# Altium schematic sheet ShV_1.SchDoc
size A4; Organization: Altium Limited; Address1: L3, 12a Rodborough Rd; Address2: Frenchs Forest; Address3: NSW; Address4: Australia 2086
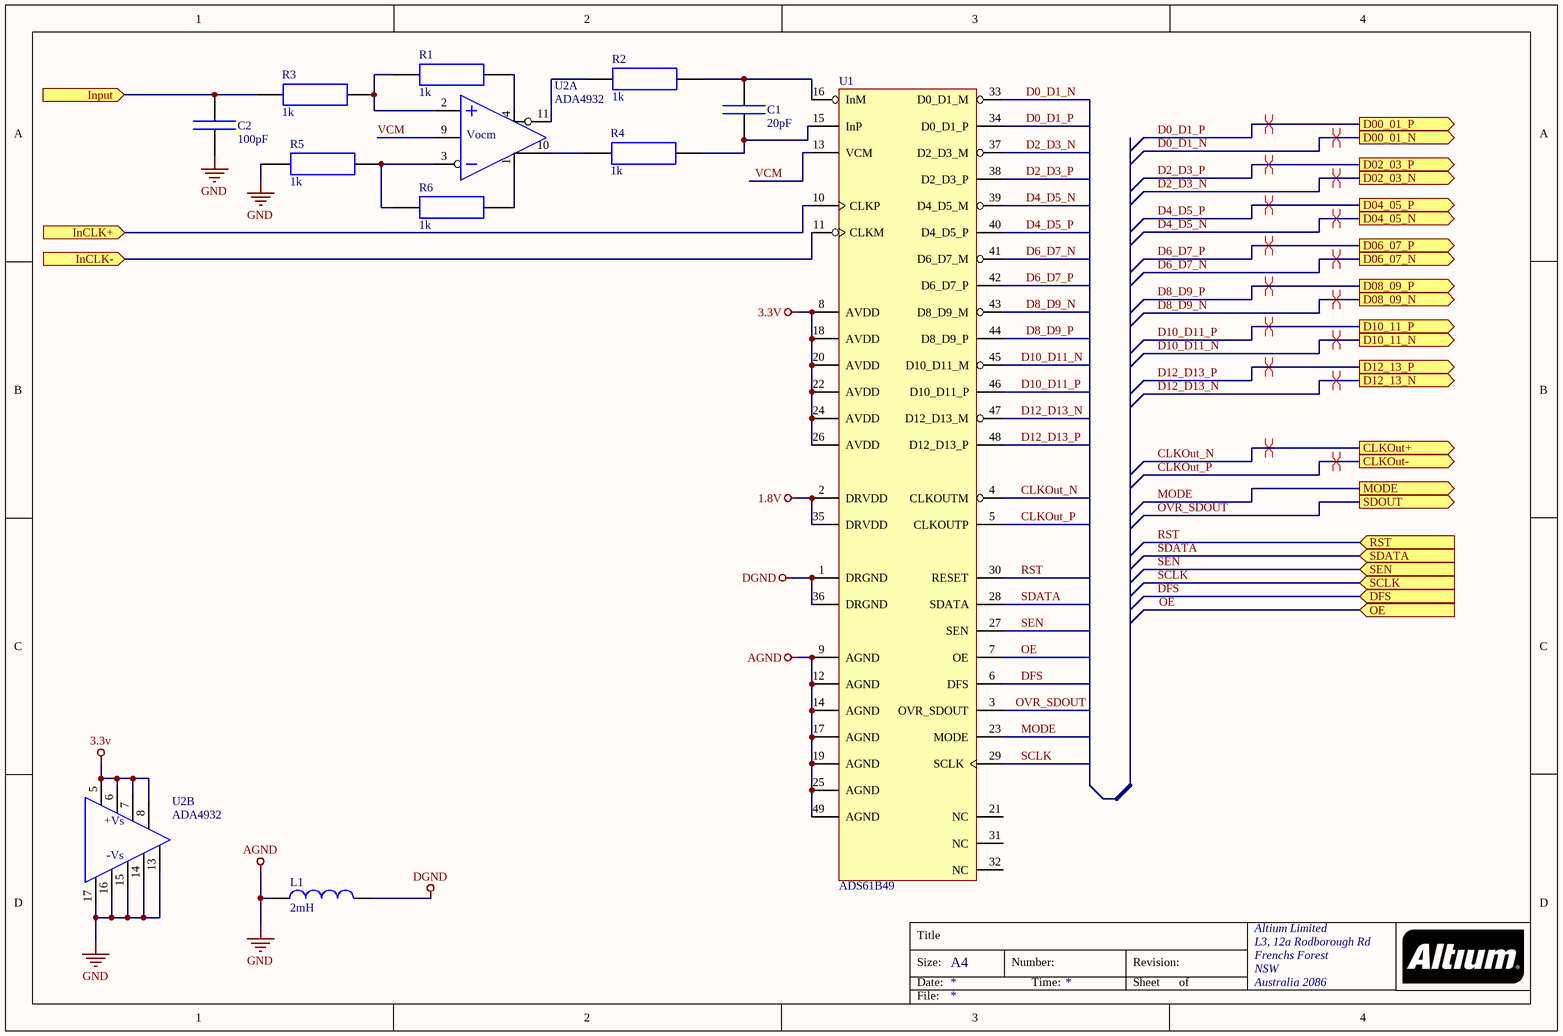
[diagram p0: ShV_1.SchDoc]

## Parts
C1  20pF  [CAP_0603]
C2  100pF  [CAP_0603]
L1  2mH  [IND_0603]
R1  1k  [RES_0603]
R2  1k  [RES_0603]
R3  1k  [RES_0603]
R4  1k  [RES_0603]
R5  1k  [RES_0603]
R6  1k  [RES_0603]
U1  ADS61B49  [QFN 48]
U2  ADA4932  [QFN PCP-16-2]  (parts A,B of 2)

## Ports
CLKOut+ (out), CLKOut- (out), D00_01_N (out), D00_01_P (out), D02_03_N (out), D02_03_P (out), D04_05_N (out), D04_05_P (out), D06_07_N (out), D06_07_P (out), D08_09_N (out), D08_09_P (out), D10_11_N (out), D10_11_P (out), D12_13_N (out), D12_13_P (out), DFS (in), InCLK+ (in), InCLK- (in), Input (in), MODE (out), OE (in), RST (in), SCLK (in), SDATA (in), SDOUT (out), SEN (in)

## Nets
1.8V: U1.2(DRVDD) U1.35(DRVDD)
3.3V: U1.8(AVDD) U1.18(AVDD) U1.20(AVDD) U1.22(AVDD) U1.24(AVDD) U1.26(AVDD) U2.5 U2.6 U2.7 U2.8
AGND: C2.2 L1.1 R5.1 U1.9(AGND) U1.12(AGND) U1.14(AGND) U1.17(AGND) U1.19(AGND) U1.25(AGND) U1.49(AGND) U2.13 U2.14 U2.15 U2.16 U2.17  [also labelled GND]
DGND: L1.2 U1.1(DRGND) U1.36(DRGND)
CLKOut_N: U1.4(CLKOUTM) ; port CLKOut+
CLKOut_P: U1.5(CLKOUTP) ; port CLKOut-
D0_D1_N: U1.33(D0_D1_M) ; port D00_01_N
D0_D1_P: U1.34(D0_D1_P) ; port D00_01_P
D2_D3_N: U1.37(D2_D3_M) ; port D02_03_N
D2_D3_P: U1.38(D2_D3_P) ; port D02_03_P
D4_D5_N: U1.39(D4_D5_M) ; port D04_05_N
D4_D5_P: U1.40(D4_D5_P) ; port D04_05_P
D6_D7_N: U1.41(D6_D7_M) ; port D06_07_N
D6_D7_P: U1.42(D6_D7_P) ; port D06_07_P
D8_D9_N: U1.43(D8_D9_M) ; port D08_09_N
D8_D9_P: U1.44(D8_D9_P) ; port D08_09_P
D10_D11_N: U1.45(D10_D11_M) ; port D10_11_N
D10_D11_P: U1.46(D10_D11_P) ; port D10_11_P
D12_D13_N: U1.47(D12_D13_M) ; port D12_13_N
D12_D13_P: U1.48(D12_D13_P) ; port D12_13_P
DFS: U1.6(DFS) ; port DFS
InCLK+: U1.10(CLKP) ; port InCLK+
InCLK-: U1.11(CLKM) ; port InCLK-
Input: C2.1 R3.2 ; port Input
MODE: U1.23(MODE) ; port MODE
OE: U1.7(OE) ; port OE
OVR_SDOUT: U1.3(OVR_SDOUT) ; port SDOUT
RST: U1.30(RESET) ; port RST
SCLK: U1.29(SCLK) ; port SCLK
SDATA: U1.28(SDATA) ; port SDATA
SEN: U1.27(SEN) ; port SEN
VCM: U1.13(VCM) U2.9
NetC1_1: C1.1 R2.2 U1.16(InM)
NetC1_2: C1.2 R4.2 U1.15(InP)
NetR1_1: R1.1 R3.1 U2.2
NetR1_2: R1.2 U2.4
NetR2_1: R2.1 U2.11
NetR4_1: R4.1 U2.10
NetR5_2: R5.2 R6.1 U2.3
NetR6_2: R6.2 U2.1

Not connected (* = marked no-connect by the designer): U1 21(NC) 31(NC) 32(NC)

## Layout directives
differential pair: CLKOut_N, CLKOut_P, D0_D1_N, D0_D1_P, D2_D3_N, D2_D3_P, D4_D5_N, D4_D5_P, D6_D7_N, D6_D7_P, D8_D9_N, D8_D9_P, D10_D11_N, D10_D11_P, D12_D13_N, D12_D13_P

## Notes on the sheet
- Title
- Size:
- Date:
- A4
- Number:
- Time:
- Revision:
- Sheet
- of
- File:
- (in symbol Op Amp, part A) Vocm
- (in symbol Op Amp, part B) +Vs; -Vs

## Library data of the parts
C1 C2 = C
L1 = L
R1-R6 = Res
U1 = ADC
U2 = Op Amp